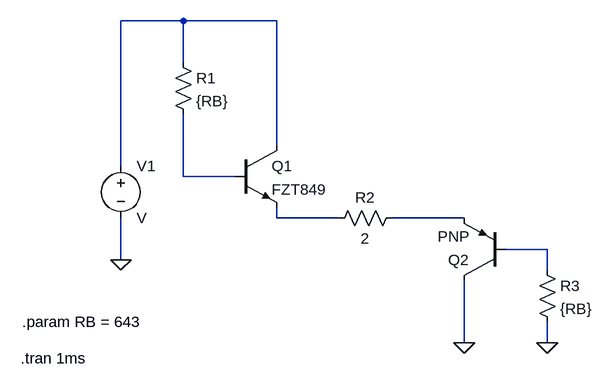
[diagram p0: schematic Draft1.asc]
Draft1.asc, the LTspice schematic file:
Version 4
SHEET 1 996 680
WIRE 352 -96 256 -96
WIRE 496 -96 352 -96
WIRE 352 -32 352 -96
WIRE 496 96 496 -96
WIRE 256 128 256 -96
WIRE 352 144 352 48
WIRE 432 144 352 144
WIRE 496 208 496 192
WIRE 592 208 496 208
WIRE 784 208 672 208
WIRE 912 256 848 256
WIRE 256 272 256 208
WIRE 912 288 912 256
WIRE 784 400 784 304
WIRE 912 400 912 368
FLAG 784 400 0
FLAG 912 400 0
FLAG 256 272 0
SYMBOL voltage 256 112 R0
SYMATTR InstName V1
SYMBOL res 336 -48 R0
SYMATTR InstName R1
SYMATTR Value {RB}
SYMBOL npn 432 96 R0
SYMATTR InstName Q1
SYMATTR Value FZT849
SYMBOL pnp 848 304 R180
SYMATTR InstName Q2
SYMBOL res 688 192 R90
WINDOW 0 0 56 VBottom 2
WINDOW 3 32 56 VTop 2
SYMATTR InstName R2
SYMATTR Value 2
SYMBOL res 896 272 R0
SYMATTR InstName R3
SYMATTR Value {RB}
TEXT 104 368 Left 2 !.param RB = 643
TEXT 102 424 Left 2 !.tran 1ms

The netlist it stands for:
* Draft1.asc
V1 N001 0 V
R1 N001 N002 {RB}
Q1 N001 N002 N003 0 FZT849
Q2 0 N005 N004 0 PNP
R2 N004 N003 2
R3 N005 0 {RB}
.model NPN NPN
.model PNP PNP
.lib standard.bjt
.param RB = 643
.tran 1ms
.backanno
.end